# Altium schematic sheet RTD_Channel.SchDoc: RTD
size 420 x 297 mm; Author: G.Kasprowicz; CompanyName: WUT ISE; DrawnBy: G.Kasprowicz; Organization: WUT ISE; Address1: PW ISE; Address2: Nowowiejska 15/19 00-665 Warsaw; Address3: gkasprow@gmail.com; DocumentNumber: 2; Revision: 1.0; SheetNumber: 2; SheetTotal: 5; ModifiedBy: -; CheckedDate: -; Title2: converter; DivGrp: WUT ISE; Designer: G.Kasprowicz; ModifiedDate: -; ProjectName: Sensor Box
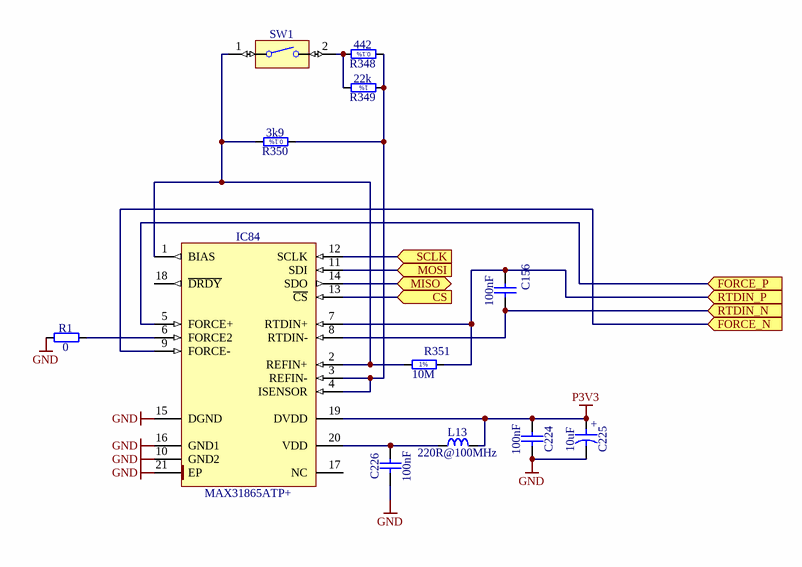
[diagram p0: RTD_Channel.SchDoc]

## Parts
C156  100nF  [CAPC1005X55N]
C224  100nF  [CAPC1005X55N]
C225  10uF  [CAPMP3216X180N]
C226  100nF  [CAPC1005X55N]
IC84  MAX31865ATP+  [QFN65P500X500X80-21N-S335]
L13  220R@100MHz  [INDC1005X55N]
R1  0  [RESC1005X40N]
R348  442  [RESC1608X55N]
R349  22k  [RESC1005X40N]
R350  3k9  [RESC1608X55N]
R351  10M  [RESC1608X55N]
SW1  Switch  [SW_OMRON_A6SN-1101]  (value not drawn)

## Ports
CS (in), FORCE_N (in), FORCE_P (in), MISO (bidir), MOSI (in), RTDIN_N (in), RTDIN_P (in), SCLK (in)

## Nets
GND: C224.2 C225.2 C226.1 IC84.10(GND2) IC84.15(DGND) IC84.16(GND1) IC84.21(EP) R1.1
P3V3: C224.1 C225.1 IC84.19(DVDD) L13.2
CS: IC84.13(~{CS}) ; port CS
FORCE_N: IC84.9(FORCE-) ; port FORCE_N
FORCE_P: IC84.5(FORCE+) ; port FORCE_P
MISO: IC84.14(SDO) ; port MISO
MOSI: IC84.11(SDI) ; port MOSI
RTDIN_N: C156.2 IC84.8(RTDIN-) ; port RTDIN_N
RTDIN_P: C156.1 IC84.7(RTDIN+) R351.2 ; port RTDIN_P
SCLK: IC84.12(SCLK) ; port SCLK
NetC226_2: C226.2 IC84.20(VDD) L13.1
NetIC84_1: IC84.1(BIAS) IC84.2(REFIN+) R350.2 R351.1 SW1.1
NetIC84_3: IC84.3(REFIN-) IC84.4(ISENSOR) R348.1 R349.1 R350.1
NetIC84_6: IC84.6(FORCE2) R1.2
NetR348_2: R348.2 R349.2 SW1.2

Not connected (* = marked no-connect by the designer): IC84 17(NC) 18(~{DRDY})

## Notes on the sheet
- Project/Equipment
- Document
- Designer
- Drawn by
- Check.by
- Copyright WUT ISE 2020.
  This documentation describes Open Hardware and is licensed under the CERN OHL v.1.2. You may redistribute and modify this documentation under the terms of the CERN OHL v.1.2. (http://ohwr.org/CERNOHL). This documentation is distributed WITHOUT ANY EXPRESS OR IMPLIED WARRANTY, INCLUDING OF MERCHANTABILITY, SATISFACTORY QUALITY AND FITNESS FOR A PARTICULAR PURPOSE. Please see the CERN OHL v.1.2 for applicable conditions.
- Contact
- File
- Last Mod.
- Print Date
- Sheet
- Size
- A3
- of
- Rev
- (in symbol CTE3216-18_10UF_16V_20%_AVX_TCJ) +
- (in symbol R0402_22K_1%_0.0625W_100PPM) 1%
- (in symbol R0603_10M_1%_0.1W_100PPM) 1%
- (in symbol RES_0603_3k9_0.1%_10ppm) 0.1%
- (in symbol RES_0603_442R_0.1%_25ppm) 0.1%

## Library data of the parts
C156 C224 C226 = CC0402_100NF_16V_10%_X5R: Non-polarised capacitor; Part Description: SMD Multilayer Chip Ceramic Capacitor; Manufacturer: GENERIC; Manufacturer1 Part Number: GRM155R61C104KA88D; Voltage: 16V; TC: X5R; Tolerance: ±10%; Part Number: CC0402_100NF_16V_10%_X5R; Component Kind: Standard; Component Type: Standard; Pin Count: 2; Value: 100nF; Status: None; Manufacturer Part Number: CC0402_100NF_16V_10%_X5R; Case: 0402; Mounted: Yes; Socket: No; SMD: Yes; Sense: No; Manufacturer1 Example: MURATA; Manufacturer1 ComponentHeight: 0.55mm; HelpURL: \\cern.ch\dfs\Applications\Altium\Datasheets\CC0402_X5R_MURATA_GRM.pdf; Author: CERN DEM JLC; CreateDate: 10.12.2013; LatestRevisionDate: 10.12.2013
C225 = CTE3216-18_10UF_16V_20%_AVX_TCJ: Polarised capacitor; Part Description: ESR 0R200 Tantalum Solid Electrolytic Chip Capacitor with Conductive Polymer Electrode; Manufacturer: AVX; Manufacturer Part Number: TCJA106M016R0200; Voltage: 16V; Tolerance: ±20%; Part Number: CTE3216-18_10UF_16V_20%_AVX_TCJ; Component Kind: Standard; Component Type: Standard; Pin Count: 2; Value: 10uF; Status: Preferred; Case: A; Mounted: Yes; Socket: No; SMD: Yes; Sense: No; ComponentHeight: 1.8mm; HelpURL: \\cern.ch\dfs\Applications\Altium\Datasheets\CTE_AVX_TCJ.pdf; Author: CERN DEM JLC; CreateDate: 29.03.2012; LatestRevisionDate: 29.03.2012
IC84 = MAX31865ATP+: RTD-to-Digital Converter; Manufacturer: MAXIM; PressFit: No; Bonding: No; Part Number: MAX31865ATP+; Component Kind: Standard; Component Type: Standard; Device: MAX31865ATP+; PackageDescription: QFN, 0.65mm pitch, Square; 20 pin, 5.00mm L X 5.00mm W X 0.80mm H Body (W/Thermal Tab 3.35mm X 3.35mm), IPC Medium Density; Part Description: RTD-to-Digital Converter; Manufacturer Part Number: MAX31865ATP+; Pin Count: 21; Case: QFN20; Mounted: Yes; Socket: No; SMD: Yes; Sense: No; ComponentHeight: 0.8mm; Author: CERN DEM MR; HelpURL: \\cern.ch\dfs\Applications\Altium\Datasheets\MAX31865ATP+.pdf; CreateDate: 09.06.2016; LatestRevisionDate: 09.06.2016
L13 = IND0402_MURATA_BLM15HB221SN1: Inductor; Part Description: SMD EMIFIL Suppression Chip Ferrite Bead; Manufacturer: MURATA; Power: 250mA; Resistance: 1R; Tolerance: ±25%; Part Number: IND0402_MURATA_BLM15HB221SN1; Component Kind: Standard; Component Type: Standard; Pin Count: 2; Value: 220R@100MHz; Status: None; Manufacturer Part Number: BLM15HB221SN1; Case: 0402; Mounted: Yes; Socket: No; SMD: Yes; Sense: No; ComponentHeight: 0.55mm; HelpURL: \\cern.ch\dfs\Applications\Altium\Datasheets\IND0402_MURATA_BLM15H.pdf; Author: CERN DEM JLC; CreateDate: 23.06.2009; LatestRevisionDate: 23.06.2009
R1 = R0402_0R_JUMPER: Resistor; Part Description: 1A (0.05R Max DC Resistance) Zero Ohm Jumper; Manufacturer: GENERIC; Manufacturer1 Part Number: 232270591001L; PressFit: No; Part Number: R0402_0R_JUMPER; Component Kind: Standard; Component Type: Standard; Pin Count: 2; Value: 0; Status: Not Recommended; Manufacturer Part Number: R0402_0R_JUMPER; Case: 0402; Mounted: Yes; Sense: No; Socket: No; SMD: Yes; Manufacturer1 Example: YAGEO PHYCOMP; Manufacturer1 ComponentHeight: 0.4mm; HelpURL: \\cern.ch\dfs\Applications\Altium\Datasheets\R0402_Phycomp_RC0402.pdf; Author: CERN DEM JLC; CreateDate: 03/12/2007; LatestRevisionDate: 17/10/2012
R348 = RES_0603_442R_0.1%_25ppm: Resistor - 0.1%; Part Number: R0603_442R_0.1%_0.063W_25PPM; Part Description: Thin Film Chip Resistor; Manufacturer: GENERIC; Manufacturer1 Part Number: RP73PF1J442RBTDF; Power: 0.063W; TC: ±25ppm; PressFit: No; Component Kind: Standard; Component Type: Standard; Pin Count: 2; Value: 442; Status: Not Recommended; Tolerance: ±0.1%; Manufacturer Part Number: R0603_442R_0.1%_0.063W_25PPM; Case: 0603; Mounted: Yes; Sense: No; Socket: No; SMD: Yes; Manufacturer1 Example: TYCO HOLSWORTHY; Manufacturer1 ComponentHeight: 0.5mm; HelpURL: \\cern.ch\dfs\Applications\Altium\Datasheets\R0603_Tyco_RN73.pdf; Author: GK; CreateDate: 03.12.2007; LatestRevisionDate: 13.03.2008
R349 = R0402_22K_1%_0.0625W_100PPM: Resistor - 1%; Part Description: General Purpose Thick Film Chip Resistor; Manufacturer: GENERIC; Manufacturer1 Part Number: 232270672203L; TC: ±100ppm/°C; PressFit: No; Part Number: R0402_22K_1%_0.0625W_100PPM; Component Kind: Standard; Component Type: Standard; Pin Count: 2; Value: 22k; Status: Not Recommended; Power: 0.0625W; Tolerance: ±1%; Manufacturer Part Number: R0402_22K_1%_0.0625W_100PPM; Case: 0402; Mounted: Yes; Sense: No; Socket: No; SMD: Yes; Manufacturer1 Example: YAGEO PHYCOMP; Manufacturer1 ComponentHeight: 0.4mm; HelpURL: \\cern.ch\dfs\Applications\Altium\Datasheets\R0402_Phycomp_RC0402.pdf; Author: CERN DEM JLC; CreateDate: 03.12.2007; LatestRevisionDate: 17.10.2012
R350 = RES_0603_3k9_0.1%_10ppm: Resistor - 0.1%; Part Number: R0603_3k9_0.1%_0.063W_10PPM; Part Description: Thin Film Chip Resistor; Manufacturer: GENERIC; Manufacturer1 Part Number: ERA3ARB392V; Power: 0.063W; TC: ±10ppm; PressFit: No; Component Kind: Standard; Component Type: Standard; Pin Count: 2; Value: 3k9; Status: Not Recommended; Tolerance: ±0.1%; Manufacturer Part Number: R0603_3k9_0.1%_0.063W_10PPM; Case: 0603; Mounted: Yes; Sense: No; Socket: No; SMD: Yes; Manufacturer1 Example: Panasonic; Manufacturer1 ComponentHeight: 0.5mm; HelpURL: \\cern.ch\dfs\Applications\Altium\Datasheets\R0603_Tyco_RN73.pdf; Author: GK; CreateDate: 03.12.2007; LatestRevisionDate: 13.03.2008
R351 = R0603_10M_1%_0.1W_100PPM: Resistor - 1%; Part Description: General Purpose Thick Film Chip Resistor; Manufacturer: GENERIC; Manufacturer1 Part Number: CRCW060310M0FKEA; Power: 0.1W; TC: ±100ppm/°C; PressFit: No; Part Number: R0603_10M_1%_0.1W_100PPM; Component Kind: Standard; Component Type: Standard; Pin Count: 2; Value: 10M; Status: Preferred; Tolerance: ±1%; Manufacturer Part Number: R0603_10M_1%_0.1W_100PPM; Case: 0603; Mounted: Yes; Sense: No; Socket: No; SMD: Yes; Manufacturer1 Example: VISHAY; Manufacturer1 ComponentHeight: 0.55mm; HelpURL: \\cern.ch\dfs\Applications\Altium\Datasheets\R0603_VISHAY_CRCW e3.pdf; Author: CERN DEM JLC; CreateDate: 12.01.2017; LatestRevisionDate: 12.01.2017
SW1 = SW_OMRON_A6SN-1101: 1 Ways SPST DIP Switch; Part Description: 1 Way SPST Surface-Mounting Slide Switch With Flat Actuator, Contact Rating 25mA 24VDC; Manufacturer: OMRON; PressFit: No; Part Number: SW_OMRON_A6SN-1101; Component Kind: Standard; Component Type: Standard; Pin Count: 2; PackageDescription: Body 4.48x7.5mm, 1 Way SPST Surface-Mounting Slide Switch With Flat Actuator (A6SN Series); Family: Switch; Mounted: Yes; Socket: No; SMD: Yes; Sense: No; Status: None; Manufacturer Part Number: A6SN-1101; ComponentHeight: 4.6mm; HelpURL: \\cern.ch\dfs\Applications\Altium\Datasheets\SW_OMRON_A6SN-1101.pdf; Author: CERN DEM JLC; CreateDate: 25.02.2013; LatestRevisionDate: 25.02.2013